# EAGLE design ring (EAGLE 7.1.0)
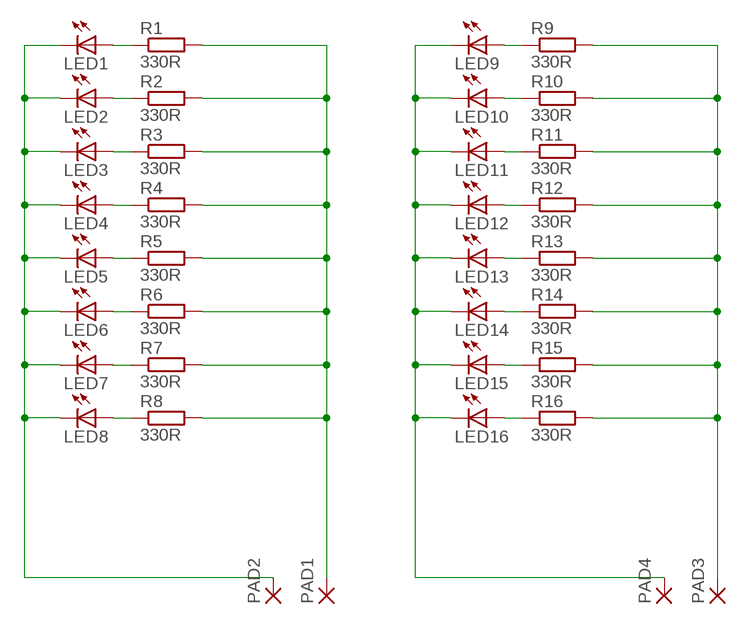
[diagram p0: schematic, sheet 1]

## Parts
LED1  LEDKA-3528ASYC  [KA-3528ASYC]
LED2  LEDKA-3528ASYC  [KA-3528ASYC]
LED3  LEDKA-3528ASYC  [KA-3528ASYC]
LED4  LEDKA-3528ASYC  [KA-3528ASYC]
LED5  LEDKA-3528ASYC  [KA-3528ASYC]
LED6  LEDKA-3528ASYC  [KA-3528ASYC]
LED7  LEDKA-3528ASYC  [KA-3528ASYC]
LED8  LEDKA-3528ASYC  [KA-3528ASYC]
LED9  LEDKA-3528ASYC  [KA-3528ASYC]
LED10  LEDKA-3528ASYC  [KA-3528ASYC]
LED11  LEDKA-3528ASYC  [KA-3528ASYC]
LED12  LEDKA-3528ASYC  [KA-3528ASYC]
LED13  LEDKA-3528ASYC  [KA-3528ASYC]
LED14  LEDKA-3528ASYC  [KA-3528ASYC]
LED15  LEDKA-3528ASYC  [KA-3528ASYC]
LED16  LEDKA-3528ASYC  [KA-3528ASYC]
PAD1  SMD2  [SMD1,27-2,54]
PAD2  SMD2  [SMD1,27-2,54]
PAD3  SMD2  [SMD1,27-2,54]
PAD4  SMD2  [SMD1,27-2,54]
R1  330R  R-EU_R0805W  [R0805W]
R2  330R  R-EU_R0805W  [R0805W]
R3  330R  R-EU_R0805W  [R0805W]
R4  330R  R-EU_R0805W  [R0805W]
R5  330R  R-EU_R0805W  [R0805W]
R6  330R  R-EU_R0805W  [R0805W]
R7  330R  R-EU_R0805W  [R0805W]
R8  330R  R-EU_R0805W  [R0805W]
R9  330R  R-EU_R0805W  [R0805W]
R10  330R  R-EU_R0805W  [R0805W]
R11  330R  R-EU_R0805W  [R0805W]
R12  330R  R-EU_R0805W  [R0805W]
R13  330R  R-EU_R0805W  [R0805W]
R14  330R  R-EU_R0805W  [R0805W]
R15  330R  R-EU_R0805W  [R0805W]
R16  330R  R-EU_R0805W  [R0805W]

## Nets
N$1: PAD1.1(P) R1.2 R2.2 R3.2 R4.2 R5.2 R6.2 R7.2 R8.2
N$2: LED1.C LED2.C LED3.C LED4.C LED5.C LED6.C LED7.C LED8.C PAD2.1(P)
N$3: LED1.A R1.1
N$4: LED2.A R2.1
N$5: LED3.A R3.1
N$6: LED4.A R4.1
N$7: LED5.A R5.1
N$8: LED6.A R6.1
N$9: LED7.A R7.1
N$10: LED8.A R8.1
N$11: PAD3.1(P) R9.2 R10.2 R11.2 R12.2 R13.2 R14.2 R15.2 R16.2
N$12: LED9.C LED10.C LED11.C LED12.C LED13.C LED14.C LED15.C LED16.C PAD4.1(P)
N$13: LED9.A R9.1
N$14: LED10.A R10.1
N$15: LED11.A R11.1
N$16: LED12.A R12.1
N$17: LED13.A R13.1
N$18: LED14.A R14.1
N$19: LED15.A R15.1
N$20: LED16.A R16.1

## Library data of the parts
LED1-LED16 = led:LED: LED OSRAM: - CHIPLED LG R971, LG N971, LY N971, LG Q971, LY Q971, LO R971, LY R971 LH N974, LH R974 LS Q976, LO Q976, LY Q976 LO Q996 - Hyper CHIPLED LW Q18S LB Q993, LB Q99A, LB R99A - SideLED LS A670, LO A670, LY A670, LG A670, LP A670 LB A673, LV A673, LT A673, LW A673 LH A674 LY A675 LS A676, LA A676, LO A676, LY A676, LW A676 LS A679, LY A679, LG A679 - Hyper Micro SIDELED® LS Y876, LA Y876, LO Y876, LY Y876 LT Y87S - SmartLED LW L88C, LW L88S LB L89C, LB L89S, LG L890 LS L89K, LO L89K, LY L89K LS L896, LA L896, LO L896, LY L896 - TOPLED LS T670, LO T670, LY T670, LG T670, LP T670 LSG T670, LSP T670, LSY T670, LOP T670, LYG T670 LG T671, LOG T671, LSG T671 LB T673, LV T673, LT T673, LW T673 LH T674 LS T676, LA T676, LO T676, LY T676, LB T676, LH T676, LSB T676, LW T676 LB T67C, LV T67C, LT T67C, LS T67K, LO T67K, LY T67K, LW E67C LS E67B, LA E67B, LO E67B, LY E67B, LB E67C, LV E67C, LT E67C LW T67C LS T679, LY T679, LG T679 LS T770, LO T770, LY T770, LG T770, LP T770 LB T773, LV T773, LT T773, LW T773 LH T774 LS E675, LA E675, LY E675, LS T675 LS T776, LA T776, LO T776, LY T776, LB T776 LHGB T686 LT T68C, LB T68C - Hyper Mini TOPLED® LB M676 - Mini TOPLED Santana® LG M470 LS M47K, LO M47K, LY M47K Source: http://www.osram.convergy.de LUXEON: - LUMILED® LXK2-PW12-R00, LXK2-PW12-S00, LXK2-PW14-U00, LXK2-PW14-V00 LXK2-PM12-R00, LXK2-PM12-S00, LXK2-PM14-U00 LXK2-PE12-Q00, LXK2-PE12-R00, LXK2-PE12-S00, LXK2-PE14-T00, LXK2-PE14-U00 LXK2-PB12-K00, LXK2-PB12-L00, LXK2-PB12-M00, LXK2-PB14-N00, LXK2-PB14-P00, LXK2-PB14-Q00 LXK2-PR12-L00, LXK2-PR12-M00, LXK2-PR14-Q00, LXK2-PR14-R00 LXK2-PD12-Q00, LXK2-PD12-R00, LXK2-PD12-S00 LXK2-PH12-R00, LXK2-PH12-S00 LXK2-PL12-P00, LXK2-PL12-Q00, LXK2-PL12-R00 Source: www.luxeon.com KINGBRIGHT: KA-3528ASYC Source: www.kingbright.com
PAD1-PAD4 = wirepad:SMD2: SMD PAD
R1-R16 = rcl:R-EU_: RESISTOR, European symbol

## Board
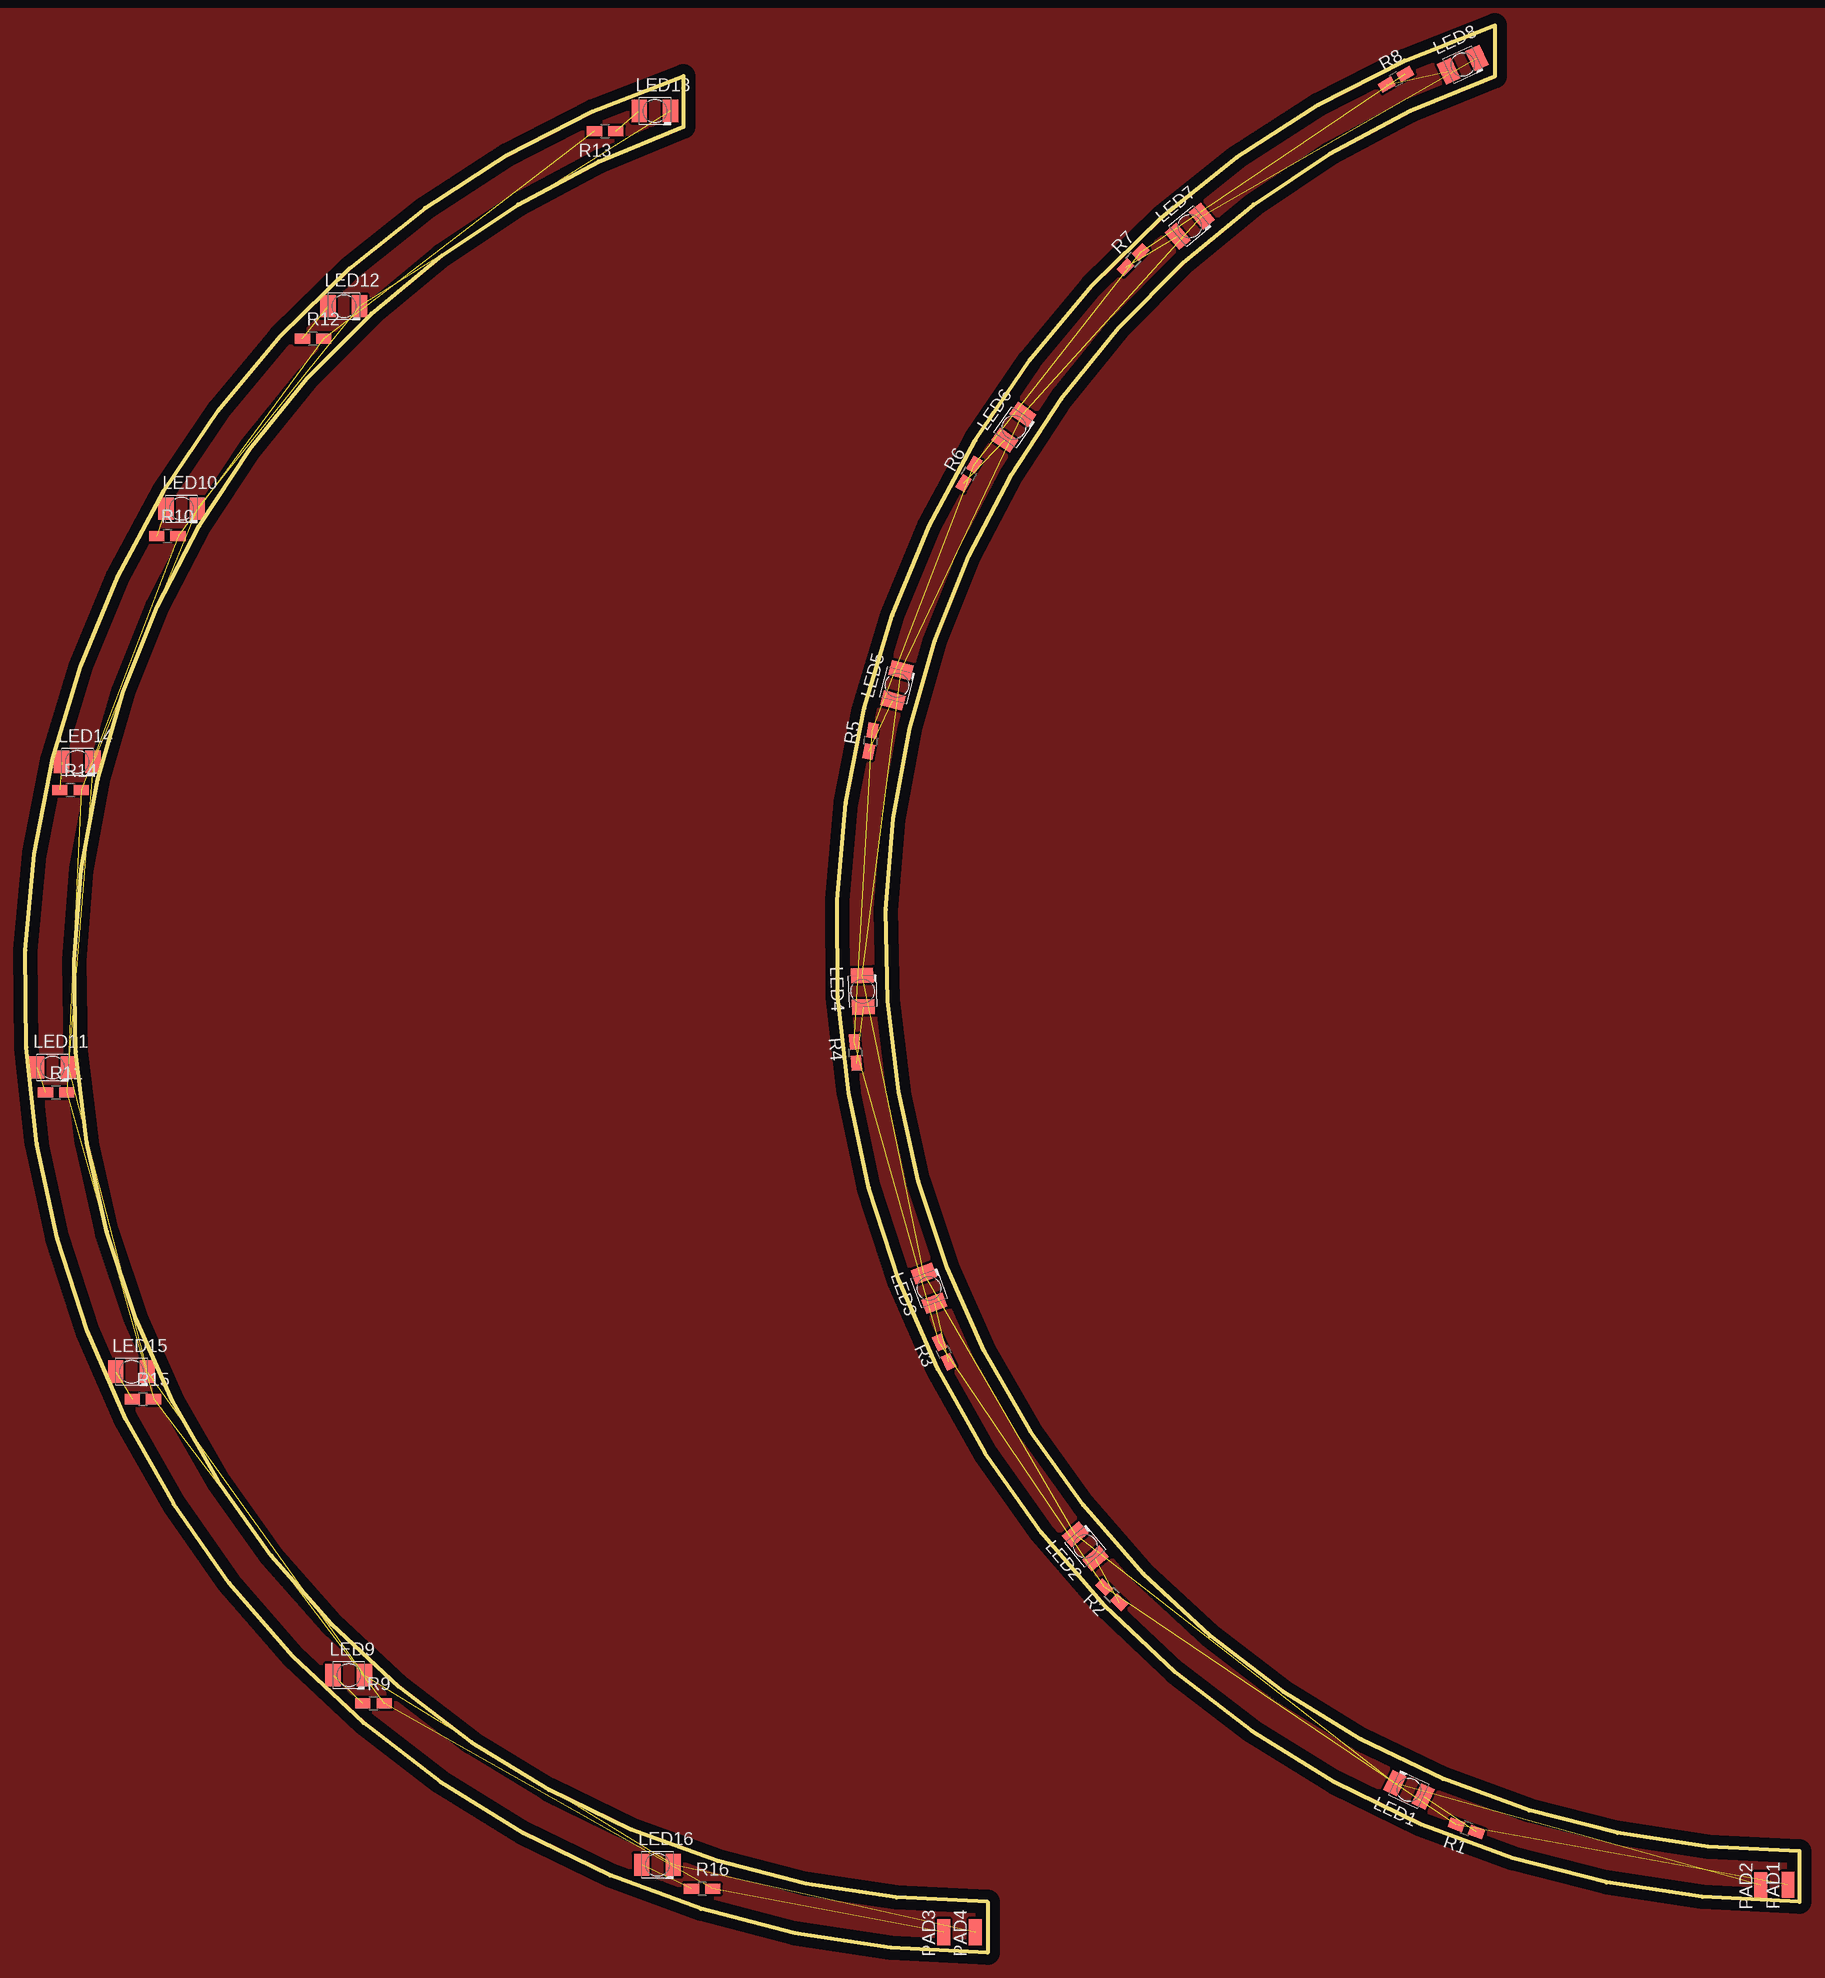
[diagram p1: board, top side]

Size 174.85 x 190 mm. Coordinates in mm from the lower left corner, seen from the top.
Outline: 94.85,5 arc-161 64.85,180 64.85,185 arc162 94.85,0 94.85,5
Outline: 174.85,10 arc-161 144.85,185 144.85,190 arc162 174.85,5 174.85,10
Copper layers (1*16): Top 0.035mm / dielectric 1.5mm / Bottom 0.035mm
Design rules "default": minimum track width 10mil, minimum drill 24mil, track to track 8mil, track to pad 8mil, pad to pad 8mil, via to via 8mil, smd to smd 8mil, copper to edge 40mil, drill to drill 8mil, minimum pad ring 10mil, minimum via ring 8mil, stop-mask expansion 4mil, vias tented up to drill 0mil, thermal gap 10mil

### Footprints (pad centres in the part's own frame; a part is rotated, then mirrored left to right if it is on the bottom)
KA-3528ASYC = smd 1.5 x 2.2: A -1.55,0; C 1.55,0
SMD1,27-2,54 = smd 1.27 x 2.54: 1 0,0
R0805W = smd 1.5 x 1: 1 -1.052,0; 2 1.052,0

### Placement (x,y rotation side)
LED1  136.37,16.05 155 top
LED2  104.48,40.05 130 top
LED3  89.07,65.48 110 top
LED4  82.52,94.78 92 top
LED5  85.92,124.94 75 top
LED6  97.43,150.38 55 top
LED7  114.77,170.2 40 top
LED8  141.67,186.14 25 top
LED9  31.88,27.35 0 top
LED10  15.4,142.35 0 top
LED11  2.67,87.26 0 top
LED12  31.39,162.31 0 top
LED13  62.04,181.56 0 top
LED14  5.12,117.39 0 top
LED15  10.46,57.26 0 top
LED16  62.3,8.66 0 top
PAD1  173.73,6.69 0 top
PAD2  171.06,6.65 0 top
PAD3  90.51,2.01 0 top
PAD4  93.62,2.01 0 top
R1  142.04,12.25 160 top
R2  107.08,35.29 135 top
R3  90.53,59.2 115 top
R4  81.81,88.74 95 top
R5  83.31,119.44 80 top
R6  93.01,145.79 60 top
R7  109.18,166.9 45 top
R8  135.08,184.68 30 top
R9  34.32,24.56 0 top
R10  14,139.66 0 top
R11  3.03,84.78 0 top
R12  28.36,159.12 0 top
R13  57.14,179.55 180 top
R14  4.45,114.59 0 top
R15  11.58,54.56 0 top
R16  66.71,6.28 0 top

### Tracks (layer width: path | path; a pad name or v marks a point on that pad's centre or on a via)
GND
  pour Top (isolate 0.254): 190.73,-8.5 -7.39,-8.5 -7.39,191.52 190.73,191.52
N$1  (8 unrouted)
N$2  (8 unrouted)
N$3  (1 unrouted)
N$4  (1 unrouted)
N$5  (1 unrouted)
N$6  (1 unrouted)
N$7  (1 unrouted)
N$8  (1 unrouted)
N$9  (1 unrouted)
N$10  (1 unrouted)
N$11  (8 unrouted)
N$12  (8 unrouted)
N$13  (1 unrouted)
N$14  (1 unrouted)
N$15  (1 unrouted)
N$16  (1 unrouted)
N$17  (1 unrouted)
N$18  (1 unrouted)
N$19  (1 unrouted)
N$20  (1 unrouted)